# Altium schematic sheet Schematic.SchDoc
size A3; SheetNumber: 1; SheetTotal: 1
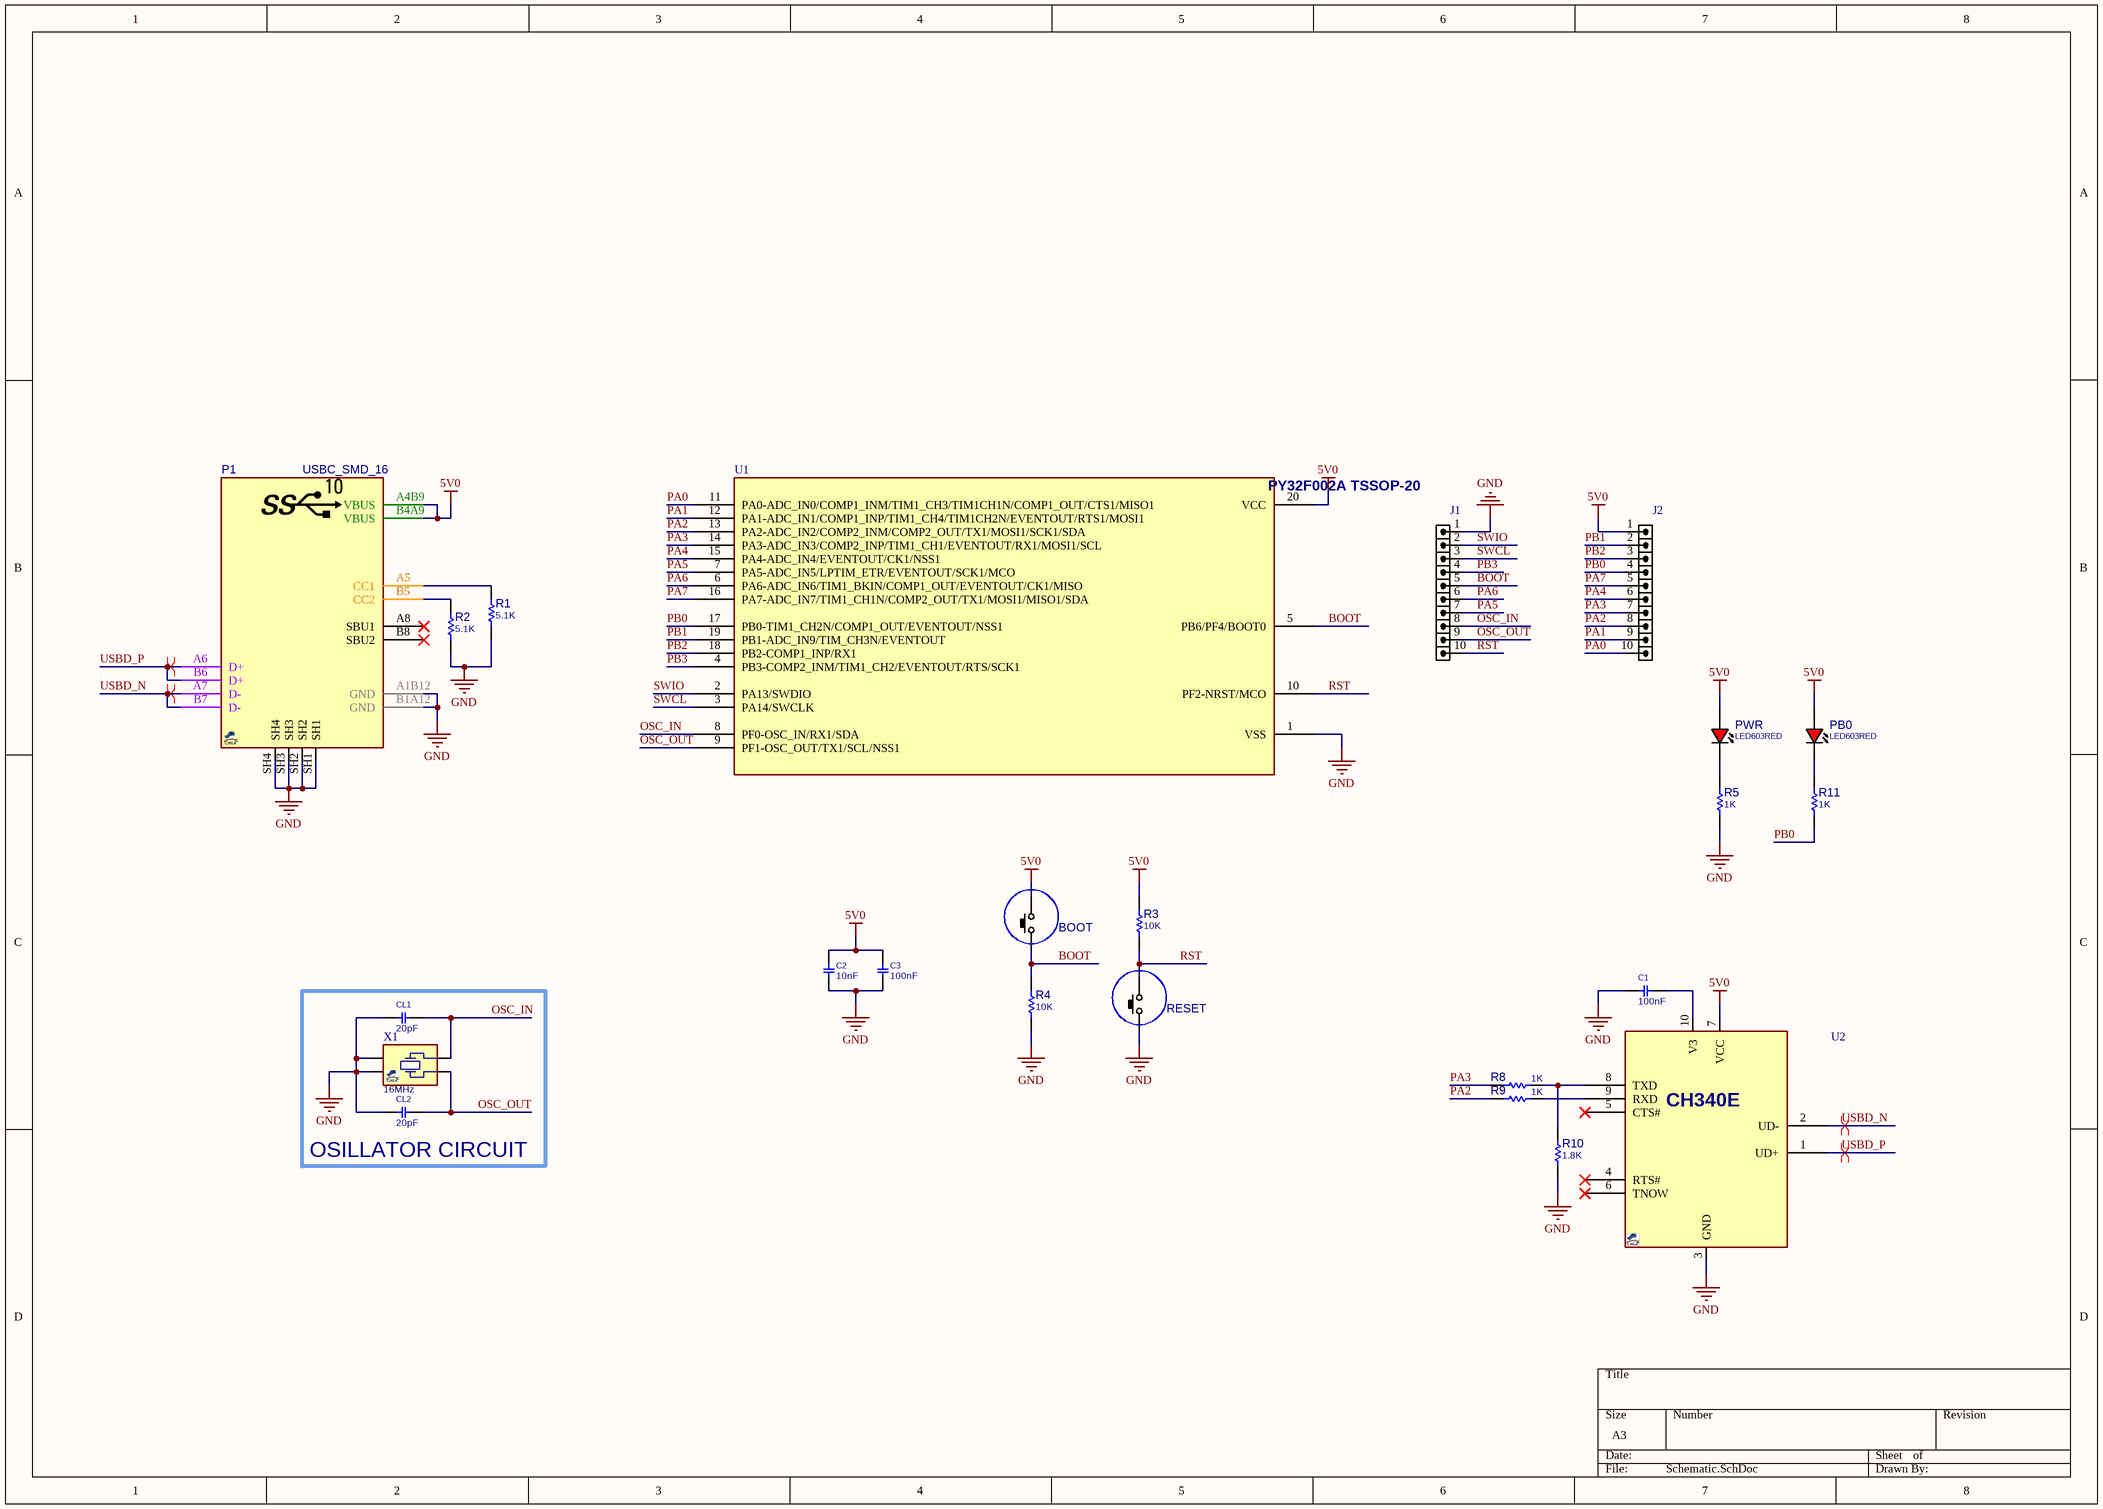
[diagram p0: Schematic.SchDoc]

## Parts
BOOT  PUSHBUTTON  [SWPBS_SPST_3X2X1]  (value not drawn)
C1  100nF  [C0805]
C2  10nF  [C0805]
C3  100nF  [C0805]
CL1  20pF  [C0805]
CL2  20pF  [C0805]
J1  HDR1X10  [HDR_M_1X10]  (value not drawn)
J2  HDR1X10  [HDR_M_1X10]  (value not drawn)
P1  USBC_SMD_16  [USBC_SMD_16_2171790001]
PB0  LED603RED  [LED0603RED]
PWR  LED603RED  [LED0603RED]
R1  5.1K  [R0603]
R2  5.1K  [R0603]
R3  10K  [R0603]
R4  10K  [R0603]
R5  1K  [R0603]
R8  1K  [R0603]
R9  1K  [R0603]
R10  1.8K  [R0603]
R11  1K  [R0603]
RESET  PUSHBUTTON  [SWPBS_SPST_3X2X1]  (value not drawn)
U1  PY32F002A  [SOG65_20]  (value not drawn)
U2  CH340E  [SOG50_10]  (value not drawn)
X1  16MHz  [XTL_4_2520]

## Blocks framed on the sheet
OSILLATOR CIRCUIT: CL1 CL2 X1

## Nets
5V0: BOOT.2(P3) C2.2 C3.2 J2.1 P1.A4B9(VBUS) P1.B4A9(VBUS) PB0.1(ANODE) PWR.1(ANODE) R3.2 U1.20(VCC) U2.7(VCC)
GND: C1.2 C2.1 C3.1 CL1.1 CL2.1 J1.1 P1.A1B12(GND) P1.B1A12(GND) P1.SH1 P1.SH2 P1.SH3 P1.SH4 R1.1 R2.1 R4.1 R5.1 R10.2 RESET.1(P1) U1.1(VSS) U2.3(GND) X1.2 X1.4
BOOT: BOOT.1(P1) J1.5 R4.2 U1.5(PB6/PF4/BOOT0)
OSC_IN: CL1.2 J1.8 U1.8(PF0-OSC_IN/RX1/SDA) X1.1
OSC_OUT: CL2.2 J1.9 U1.9(PF1-OSC_OUT/TX1/SCL/NSS1) X1.3
PA0: J2.10 U1.11(PA0-ADC_IN0/COMP1_INM/TIM1_CH3/TIM1CH1N/COMP1_OUT/CTS1/MISO1)
PA1: J2.9 U1.12(PA1-ADC_IN1/COMP1_INP/TIM1_CH4/TIM1CH2N/EVENTOUT/RTS1/MOSI1)
PA2: J2.8 R9.2 U1.13(PA2-ADC_IN2/COMP2_INM/COMP2_OUT/TX1/MOSI1/SCK1/SDA)
PA3: J2.7 R8.2 U1.14(PA3-ADC_IN3/COMP2_INP/TIM1_CH1/EVENTOUT/RX1/MOSI1/SCL)
PA4: J2.6 U1.15(PA4-ADC_IN4/EVENTOUT/CK1/NSS1)
PA5: J1.7 U1.7(PA5-ADC_IN5/LPTIM_ETR/EVENTOUT/SCK1/MCO)
PA6: J1.6 U1.6(PA6-ADC_IN6/TIM1_BKIN/COMP1_OUT/EVENTOUT/CK1/MISO)
PA7: J2.5 U1.16(PA7-ADC_IN7/TIM1_CH1N/COMP2_OUT/TX1/MOSI1/MISO1/SDA)
PB0: J2.4 R11.1 U1.17(PB0-TIM1_CH2N/COMP1_OUT/EVENTOUT/NSS1)
PB1: J2.2 U1.19(PB1-ADC_IN9/TIM_CH3N/EVENTOUT)
PB2: J2.3 U1.18(PB2-COMP1_INP/RX1)
PB3: J1.4 U1.4(PB3-COMP2_INM/TIM1_CH2/EVENTOUT/RTS/SCK1)
RST: J1.10 R3.1 RESET.2(P3) U1.10(PF2-NRST/MCO)
SWCL: J1.3 U1.3(PA14/SWCLK)
SWIO: J1.2 U1.2(PA13/SWDIO)
USBD_N: P1.A7(D-) P1.B7(D-) U2.2(UD-)
USBD_P: P1.A6(D+) P1.B6(D+) U2.1(UD+)
NetC1_1: C1.1 U2.10(V3)
NetP1_A5: P1.A5(CC1) R1.2
NetP1_B5: P1.B5(CC2) R2.2
NetPB0_2: PB0.2(CATHODE) R11.2
NetPWR_2: PWR.2(CATHODE) R5.2
NetR8_1: R8.1 R10.1 U2.8(TXD)
NetR9_1: R9.1 U2.9(RXD)

Not connected (* = marked no-connect by the designer): P1 A8(SBU1)* B8(SBU2)*; U2 4(RTS#)* 5(CTS#)* 6(TNOW)*

## Layout directives
differential pair: USBD_N, USBD_P

## Notes on the sheet
- (in symbol PY32F002AF15P6TU_TSSOP20) PY32F002A TSSOP-20

## Library data of the parts
BOOT RESET = SWPBS_SPST_3X2_B3U-1000P: SWITCH, PUSH BUTTON, TACTILE, SMD, SPST, 3X2.5X1.2mm; MANF: OMRON; DESC: DESCRIPTION; VALUE: PUSHBUTTON; ASSEMBLY: ASSEMBLY; PARAM: PARAM; PRICE: 1$; MANF_P#: B3U-1000P
C1-C3 CL1 CL2 = CAP_SMD_MLCC: CAP, MLCC; PARAM: C0G, 10%; DESC: CAP, MLCC, 1nF, 50V, C0G, 10%, 0402; MANF_P#: MANF_PART#; MANF: Murata; PARAM2: 50V; PRICE: 100= 1$; ASSEMBLY: ASSEMBLY
  C1 C3: VALUE: 100nF
  C2: VALUE: 10nF
  CL1 CL2: VALUE: 20pF
J1 J2 = HDR_M_1X10: CONN, HEADER, Male, pitch: 2.54mm, 10POS; VALUE: HDRM10
P1 = CONN_USBC_SMD_16_2171790001: CONN, USB, Type C, USB 2.0, Right-Angle, SMD; MANF: MOLEX; PARAM: 5A; Price: 1.5$; MANF_P#: 2171790001; Value: USBC_SMD_16
PB0 PWR = LED_SMD_0603_RED: LED, SMD, 0603, RED; PARAM: 30mA, 640nm; DESC: DESCRIPTION; MANF_P#: MANF_PART#; PARAM2: 1.8~2.5V; MANF: MANF; ASSEMBLY: ASSEMBLY; PRICE: PRICE; VALUE: LED603RED
R1-R5 R8-R11 = RES_SMD: RESISTOR, SMD; PARAM: -W; DESC: DESCRIPTION; DIST#: MOUSER; PARAM2: 1%; MANF_P#: -; MANF: -; ASSEMBLY: ASSEMBLY; PRICE: 100= 0.5$
  R1 R2: VALUE: 5.1K
  R3 R4: VALUE: 10K
  R5 R8 R9 R11: VALUE: 1K
  R10: VALUE: 1.8K
U1 = PY32F002AF15P6TU_TSSOP20: MCU, PYUA32 ARM 32-bit, Cortex-M0+, 20KB FLASH, 3KB SRAM; DESC: I2C, SPI, UART; MANF: PY; PARAM2: 2.4~3.6VCC, 48MHz, 1X12Bit ADC; PARAM: 20KB FLASH, 3KB SRAM, -40~85oC; MANF_P#: PY32F002AF15P6TU; PRICE: 1$; VALUE: PY32F002A; PACKAGE: TSSOP-20
U2 = CH340E_MSOP10: USB-UART; MANF_P#: CH340E; VALUE: CH340E; PACKAGE: MSOP-10
X1 = XTL_4_16MHz_2520: Crystal 16MHz; MANF: ABRACON; MANF_P#: ABM10W-16.0000MHZ-4-D1X-T3; PARAM: 10PPM, -40~85oC; PRICE: 0.8$; VALUE: 16MHz